# EAGLE schematic 4IO (EAGLE 6.5.0)
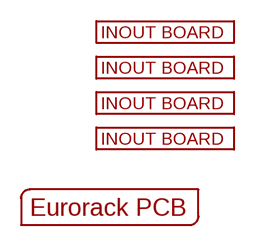
[diagram p0: schematic, sheet 1]

## Parts
U$1  EURORACK_PCB12HP  [EURORACK12HPPCB]
U$2  INOUTBOARD  [INOUTBOARD]
U$3  INOUTBOARD  [INOUTBOARD]
U$4  INOUTBOARD  [INOUTBOARD]
U$5  INOUTBOARD  [INOUTBOARD]

## Library data of the parts
U$1 = EurorackModularParts:EURORACK_PCB
U$2-U$5 = EurorackModularParts:INOUTBOARD